# Altium schematic sheet ecs8a_sch_v3_top.SchDoc
size A4
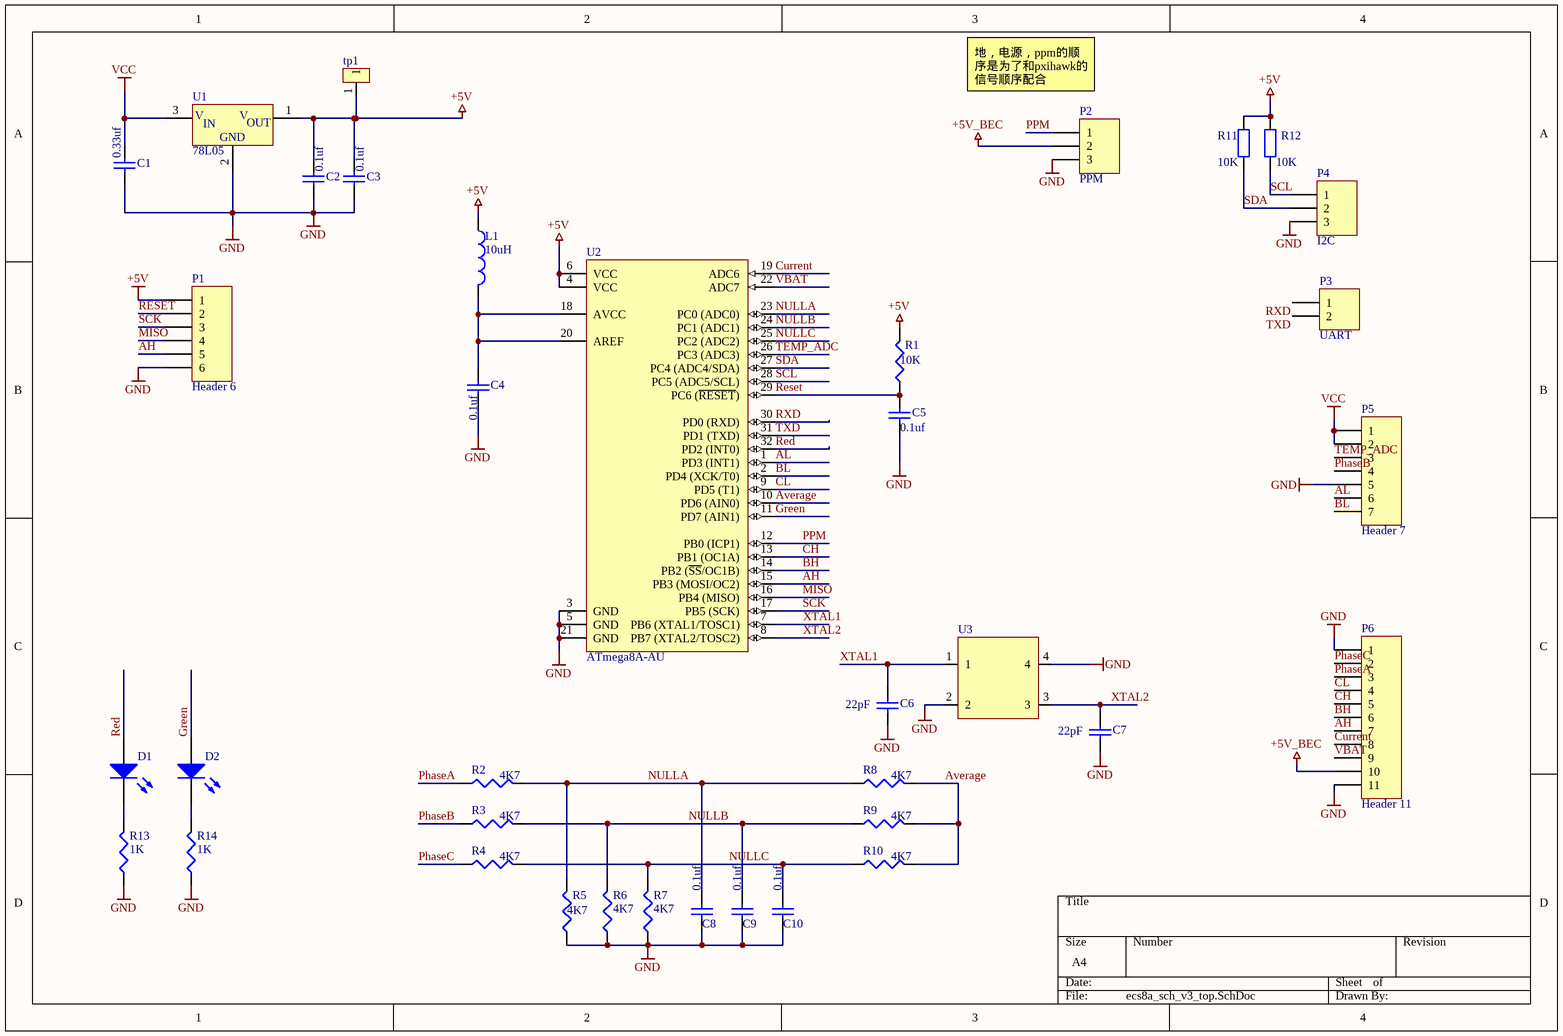
[diagram p0: ecs8a_sch_v3_top.SchDoc]

## Parts
C1  value 0.33uf  [C1206]  (hidden comment: Cap)
C2  value 0.1uf  [6-0805_L]  (hidden comment: Cap)
C3  value 0.1uf  [6-0805_L]  (hidden comment: Cap)
C4  value 0.1uf  [6-0805_L]  (hidden comment: Cap)
C5  value 0.1uf  [6-0805_L]  (hidden comment: Cap)
C6  value 22pF  [6-0805_L]  (hidden comment: Cap)
C7  value 22pF  [6-0805_L]  (hidden comment: Cap)
C8  value 0.1uf  [6-0805_L]  (hidden comment: Cap)
C9  value 0.1uf  [6-0805_L]  (hidden comment: Cap)
C10  value 0.1uf  [6-0805_L]  (hidden comment: Cap)
D1  LED0  [6-0805_L]  (value not drawn)
D2  LED0  [6-0805_L]  (value not drawn)
L1  value 10uH  [6-0805_L]  (hidden comment: Inductor)
P1  Header 6  [6pin_2mm]
P2  PPM  [PPM_HEADER2]
P3  UART  [USART_HEADER]
P4  I2C  [PPM_HEADER2]
P5  Header 7  [7PIN_2.54]
P6  Header 11  [11PIN_2.54]
R1  value 10K  [6-0805_L]  (hidden comment: Res3)
R2  value 4K7  [6-0805_L]  (hidden comment: Res3)
R3  value 4K7  [6-0805_L]  (hidden comment: Res3)
R4  value 4K7  [6-0805_L]  (hidden comment: Res3)
R5  value 4K7  [6-0805_L]  (hidden comment: Res3)
R6  value 4K7  [6-0805_L]  (hidden comment: Res3)
R7  value 4K7  [6-0805_L]  (hidden comment: Res3)
R8  value 4K7  [6-0805_L]  (hidden comment: Res3)
R9  value 4K7  [6-0805_L]  (hidden comment: Res3)
R10  value 4K7  [6-0805_L]  (hidden comment: Res3)
R11  value 10K  [6-0805_L]  (hidden comment: Res2)
R12  value 10K  [6-0805_L]  (hidden comment: Res2)
R13  value 1K  [6-0805_L]  (hidden comment: Res3)
R14  value 1K  [6-0805_L]  (hidden comment: Res3)
tp1  tp  [tp]  (value not drawn)
U1  78L05  [SOT89L]
U2  ATmega8A-AU  [32A_N]
U3  3225_16M  [3225_16M]  (value not drawn)

## Nets
+5V: C2.2 C3.2 L1.1 P1.1 R1.2 R11.2 R12.2 tp1.1 U1.1(VOUT) U2.4(VCC) U2.6(VCC)
+5V_BEC: P2.2 P6.10
GND: C1.1 C2.1 C3.1 C4.2 C5.1 C6.2 C7.2 C8.2 C9.2 C10.2 P1.6 P2.3 P4.3 P5.5 P6.1 P6.11 R5.1 R6.1 R7.1 R13.1 R14.1 U1.2(GND) U2.3(GND) U2.5(GND) U2.21(GND) U3.2 U3.4
VCC: C1.2 P5.1 P5.2 U1.3(VIN)
AH: P1.5 P6.7 U2.15(PB3_(MOSI/OC2))
AL: P5.6 U2.1(PD3_(INT1))
Average: R8.2 R9.2 R10.2 U2.10(PD6_(AIN0))
BH: P6.6 U2.14(PB2_(~{SS}/OC1B))
BL: P5.7 U2.2(PD4_(XCK/T0))
CH: P6.5 U2.13(PB1_(OC1A))
CL: P6.4 U2.9(PD5_(T1))
Current: P6.8 U2.19(ADC6)
Green: D2.1(A) U2.11(PD7_(AIN1))
MISO: P1.4 U2.16(PB4_(MISO))
NULLA: C8.1 R2.2 R5.2 R8.1 U2.23(PC0_(ADC0))
NULLB: C9.1 R3.2 R6.2 R9.1 U2.24(PC1_(ADC1))
NULLC: C10.1 R4.2 R7.2 R10.1 U2.25(PC2_(ADC2))
PhaseA: P6.3 R2.1
PhaseB: P5.4 R3.1
PhaseC: P6.2 R4.1
PPM: P2.1 U2.12(PB0_(ICP1))
Red: D1.1(A) U2.32(PD2_(INT0))
Reset: C5.2 P1.2 R1.1 U2.29(PC6_(~{RESET}))
RXD: P3.1 U2.30(PD0_(RXD))
SCK: P1.3 U2.17(PB5_(SCK))
SCL: P4.1 R12.1 U2.28(PC5_(ADC5/SCL))
SDA: P4.2 R11.1 U2.27(PC4_(ADC4/SDA))
TEMP_ADC: P5.3 U2.26(PC3_(ADC3))
TXD: P3.2 U2.31(PD1_(TXD))
VBAT: P6.9 U2.22(ADC7)
XTAL1: C6.1 U2.7(PB6_(XTAL1/TOSC1)) U3.1
XTAL2: C7.1 U2.8(PB7_(XTAL2/TOSC2)) U3.3
NetC4_1: C4.1 L1.2 U2.18(AVCC) U2.20(AREF)
NetD1_2: D1.2(K) R13.2
NetD2_2: D2.2(K) R14.2

## Notes on the sheet
- (near P2) 地，电源，ppm的顺序是为了和pxihawk的信号顺序配合
- (in symbol 78L05) V; IN; OUT

## Library data of the parts
C1-C10 = Cap: Capacitor; Published: 8-Jun-2000; LatestRevisionDate: 17-Jul-2002; LatestRevisionNote: Re-released for DXP Platform.; PackageReference: RAD-0.3; Publisher: Altium Limited; PackageDescription: Radial Cap, Thru-Hole; 2 Leads; 0.3 in Pin Spacing
D1 D2 = LED0: Typical INFRARED GaAs LED; Published: 8-Jun-2000; LatestRevisionDate: 08-Jul-2005; LatestRevisionNote: Mech Layer 1 removed.; PackageReference: LED-0; Publisher: Altium Limited
L1 = Inductor: Code_IEC: 1005; Published: 8-Jun-2000; LatestRevisionDate: 17-Jul-2002; LatestRevisionNote: Re-released for DXP Platform.; PackageReference: 0402-A; Publisher: Altium Limited; Code_JEITA: 0402
P1 = Header 6: Header, 6-Pin; LatestRevisionDate: 17-Jul-2002; LatestRevisionNote: Re-released for DXP Platform.; Publisher: Altium Limited
P2 P4 = Header 3: Header, 3-Pin; LatestRevisionDate: 17-Jul-2002; LatestRevisionNote: Re-released for DXP Platform.; Publisher: Altium Limited
P3 = Header 2: Header, 2-Pin; LatestRevisionDate: 17-Jul-2002; LatestRevisionNote: Re-released for DXP Platform.; Publisher: Altium Limited
P5 = Header 7: Header, 7-Pin; LatestRevisionDate: 17-Jul-2002; LatestRevisionNote: Re-released for DXP Platform.; Publisher: Altium Limited
P6 = Header 11: Header, 11-Pin; LatestRevisionDate: 17-Jul-2002; LatestRevisionNote: Re-released for DXP Platform.; Publisher: Altium Limited
R1-R10 R13 R14 = Res3: Resistor; Published: 8-Jun-2000; LatestRevisionDate: 29-May-2009; LatestRevisionNote: IPC-7351 Footprint Added.; PackageReference: J1-0603; Publisher: Altium Limited; PackageDescription: Chip Resistor
R11 R12 = Res2: Resistor; Published: 8-Jun-2000; LatestRevisionDate: 17-Jul-2002; LatestRevisionNote: Re-released for DXP Platform.; PackageReference: AXIAL-0.4; Publisher: Altium Limited; PackageDescription: Axial Device, Thru-Hole; 2 Leads; 0.4 in Pin Spacing
U1 = 78L05: 3-Terminal Positive Voltage Regulator
U2 = ATmega8A-AU: 8-bit AVR Microcontroller, 2.7-5.5V, 16MHz, 8KB Flash, 512 Bytes EEPROM, 1KB SRAM, 32-pin TQFP, Industrial Grade (-40癈 to 85癈); DatasheetVersion: revD, Feb-2011; PackageVersion: revC, Oct-2010; PackageReference: 32A; PackageDescription: 32-Lead, 7x7x1.0 mm Body, 0.8mm Lead Pitch, Thin Profile Plastic Quad Flat Package (TQFP); Code_JEDEC: MS-026-ABA; ComponentLink1Description: Manufacturer URL; ComponentLink1URL: http://www.atmel.com/; ComponentLink2Description: ATmega8A Datasheet; ComponentLink2URL: http://www.atmel.com/dyn/resources/prod_documents/doc8159.pdf; ComponentLink3Description: ATmega8A Summary; ComponentLink3URL: http://www.atmel.com/dyn/resources/prod_documents/8159S.pdf